# EAGLE design TouScruino-ui1-v0 (EAGLE 6.3)
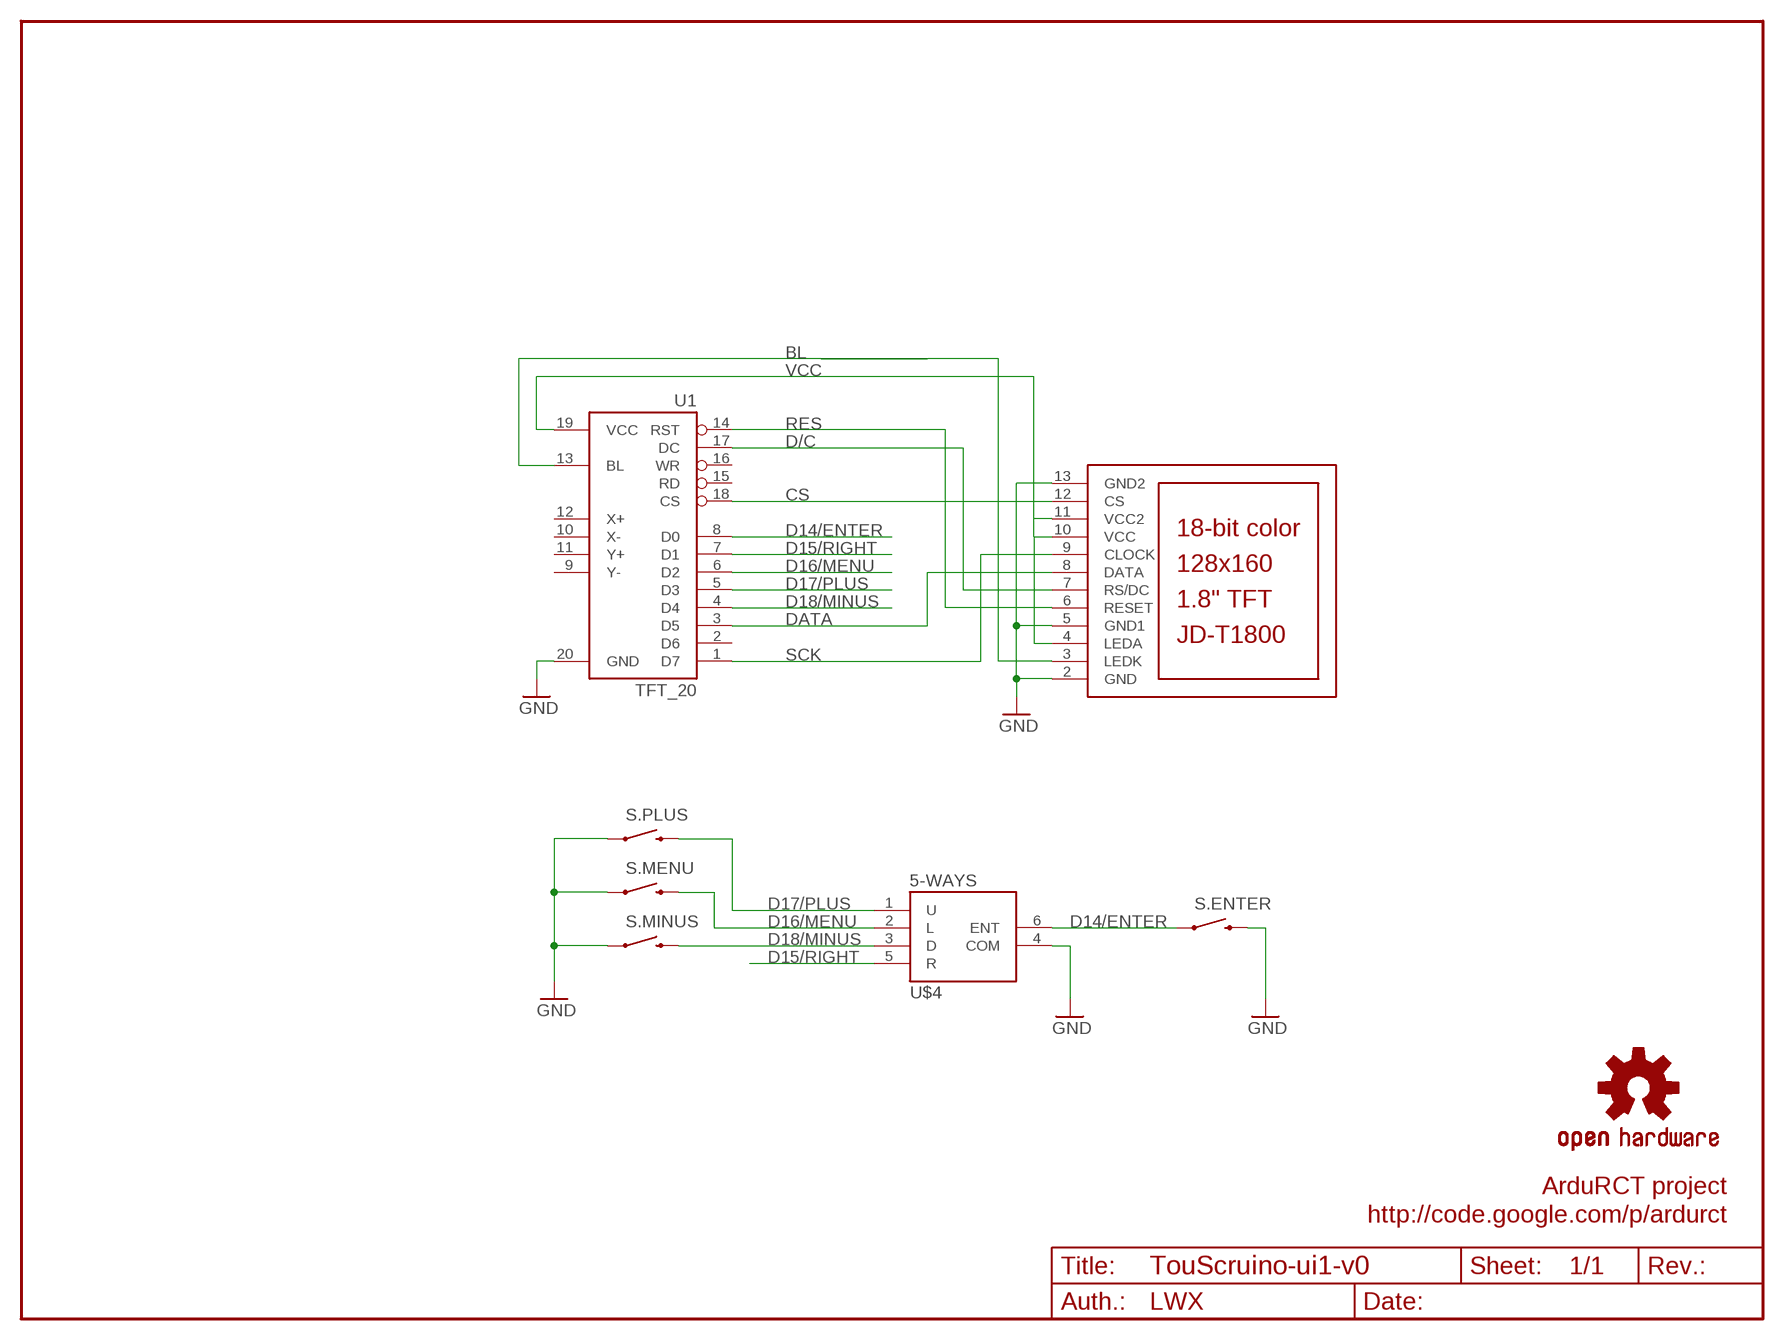
[diagram p0: schematic, sheet 1]

## Parts
LCD1  JD-T1800  [JD-T1800]
S.ENTER  SWITCH_SMD  [TACTILE_SWITCH_SMD]
S.MENU  SWITCH_SMD  [TACTILE_SWITCH_SMD]
S.MINUS  SWITCH_SMD  [TACTILE_SWITCH_SMD]
S.PLUS  SWITCH_SMD  [TACTILE_SWITCH_SMD]
U1  TFT_20  [TFT_20]
U$3  OSHW-LOGOM  [OSHW-LOGO-M]
U$4  5-WAYS  [5-WAYS_ALPS]

## Nets
BL: LCD1.3(LEDK) U1.13(BL)
CS: LCD1.12(CS) U1.18(CS)
D14/ENTER: S.ENTER.1 U1.8(D0) U$4.6(ENT)
D15/RIGHT: U1.7(D1) U$4.5(R)
D16/MENU: S.MENU.3 U1.6(D2) U$4.2(L)
D17/PLUS: S.PLUS.3 U1.5(D3) U$4.1(U)
D18/MINUS: S.MINUS.3 U1.4(D4) U$4.3(D)
D/C: LCD1.7(RS/DC) U1.17(DC)
DATA: LCD1.8(DATA) U1.3(D5)
GND: LCD1.2(GND) LCD1.5(GND1) LCD1.13(GND2) S.ENTER.3 S.MENU.1 S.MINUS.1 S.PLUS.1 U1.20(GND) U$4.4(COM)
RES: LCD1.6(RESET) U1.14(RST)
SCK: LCD1.9(CLOCK) U1.1(D7)
VCC: LCD1.4(LEDA) LCD1.10(VCC) LCD1.11(VCC2) U1.19(VCC)
Unconnected: U1.2(D6) U1.9(Y-) U1.10(X-) U1.11(Y+) U1.12(X+) U1.15(RD) U1.16(WR)

## Notes on the sheet
- ArduRCT project
- http://code.google.com/p/ardurct
- 1/1
- LWX

## Library data of the parts
LCD1 = adafruit:JD-T1800
S.ENTER S.MENU S.MINUS S.PLUS = wibauxl:SWITCH_SMD
U1 = wibauxl:TFT_20
U$3 = SparkFun:OSHW-LOGO: Open Source Hardware Logo This logo indicates the piece of hardware it is found on incorporates a OSHW license and/or adheres to the definition of open source hardware found here: http://freedomdefined.org/OSHW
U$4 = wibauxl:5-WAYS

## Net classes
0 default: width 0.203 mm
1 vcc: width 0.254 mm

## Board
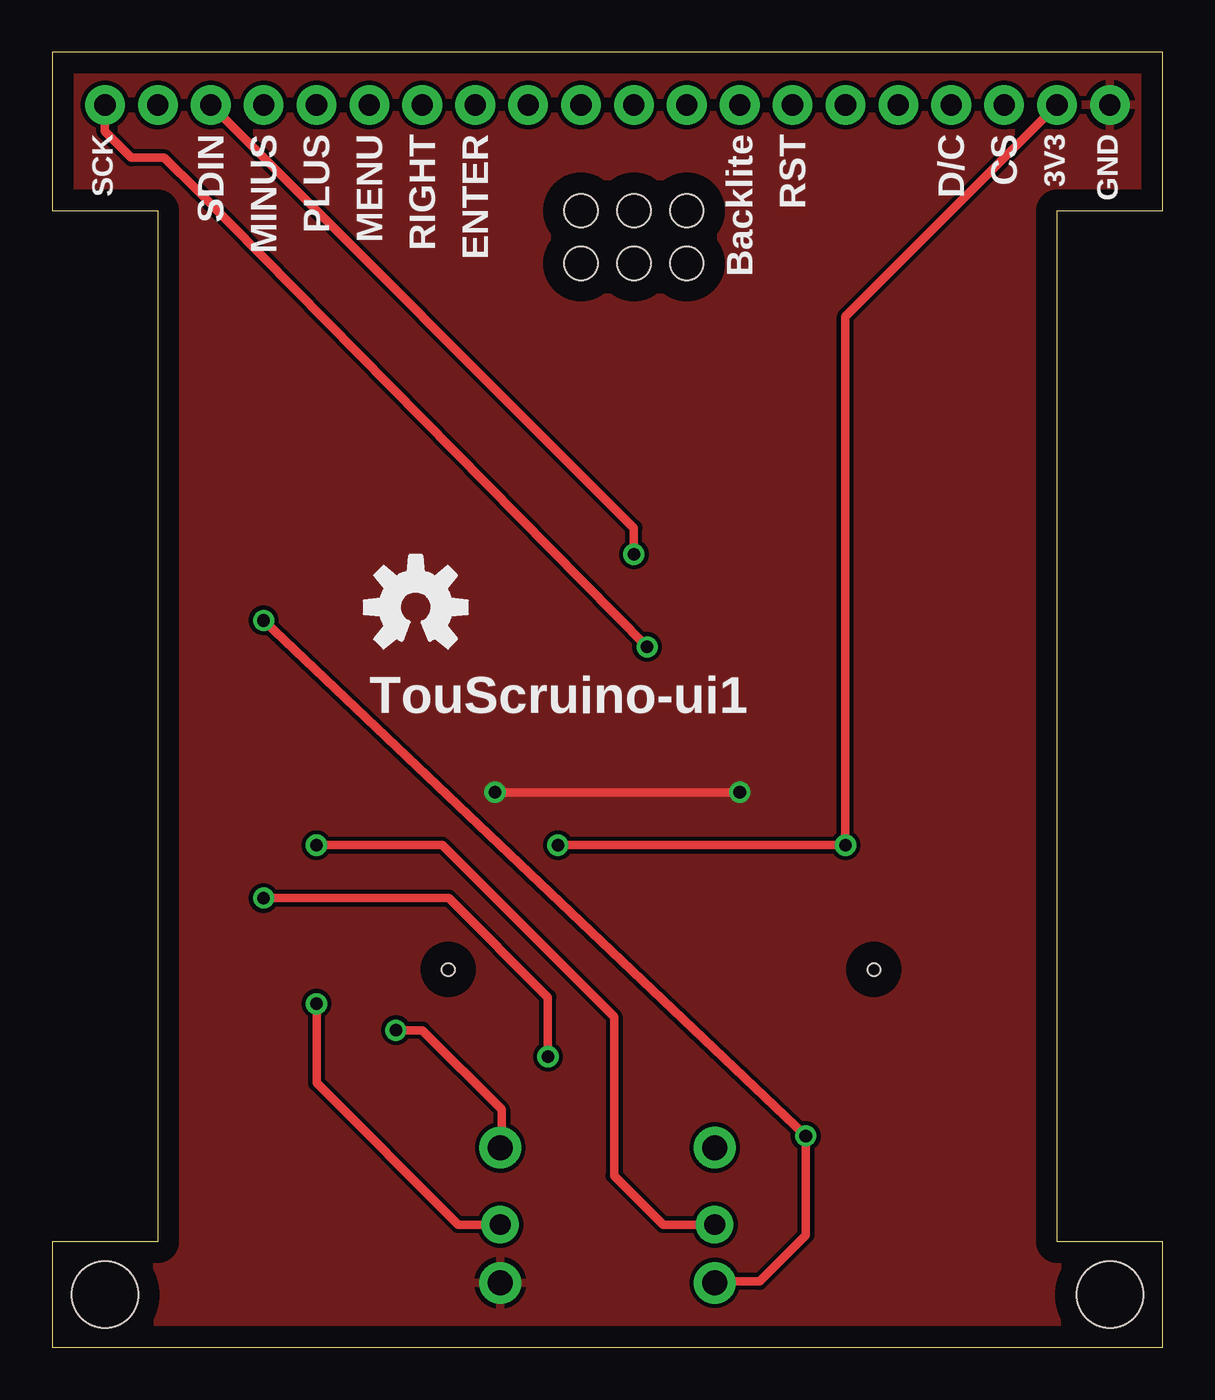
[diagram p1: board, top side]
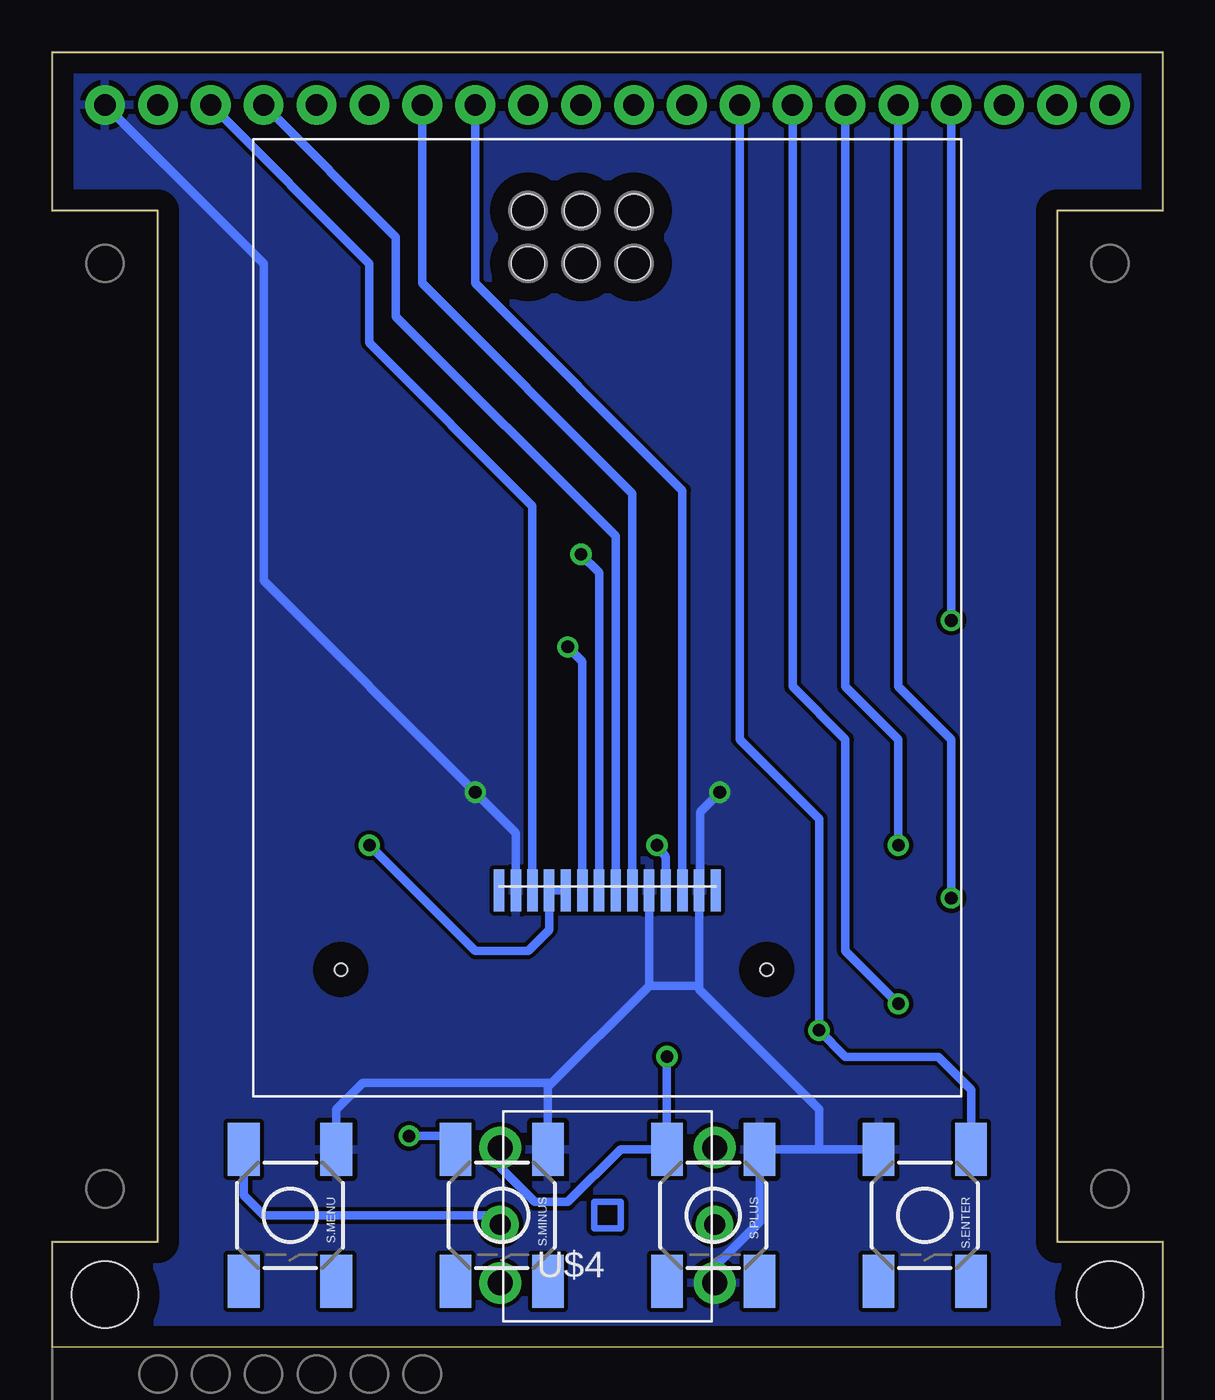
[diagram p2: board, bottom side, seen from below]

Size 53.34 x 62.23 mm. Coordinates in mm from the lower left corner, seen from the top.
Outline: 53.34,54.61 53.34,62.23 0,62.23 0,54.61 5.08,54.61 5.08,5.08 0,5.08 0,0 53.34,0 53.34,5.08 48.26,5.08 48.26,54.61 53.34,54.61
Copper layers (1*16): Top 0.035mm / dielectric 1.5mm / Bottom 0.035mm
Design rules "default": minimum track width 10mil, minimum drill 24mil, track to track 8mil, track to pad 8mil, pad to pad 8mil, via to via 8mil, smd to smd 8mil, copper to edge 40mil, drill to drill 8mil, minimum pad ring 10mil, minimum via ring 8mil, stop-mask expansion 4mil, vias tented up to drill 0mil, thermal gap 10mil
Holes 1.6 mm at 30.48,54.61 25.4,54.61 27.94,54.61 27.94,52.07 25.4,52.07 30.48,52.07
Holes 3.2 mm at 2.54,2.54 50.8,2.54

### Footprints (pad centres in the part's own frame; a part is rotated, then mirrored left to right if it is on the bottom)
JD-T1800 = smd 0.5 x 2: 1 5.2,-13.1; 2 4.4,-13.1; 3 3.6,-13.1; 4 2.8,-13.1; 5 2,-13.1; 6 1.2,-13.1; 7 0.4,-13.1; 8 -0.4,-13.1; 9 -1.2,-13.1; 10 -2,-13.1; 11 -2.8,-13.1; 12 -3.6,-13.1; 13 -4.4,-13.1; 14 -5.2,-13.1 | hole 0.61: -12.8,-16.9; 7.65,-16.9
TACTILE_SWITCH_SMD = smd 2.54 x 1.524: 1 -3.175,2.223; 2 3.175,2.223; 3 -3.175,-2.223; 4 3.175,-2.223
TFT_20 = drill 1.016 pad 1.905: 1 0,0; 2 -2.54,0; 3 -5.08,0; 4 -7.62,0; 5 -10.16,0; 6 -12.7,0; 7 -15.24,0; 8 -17.78,0; 9 -20.32,0; 10 -22.86,0; 11 -25.4,0; 12 -27.94,0; 13 -30.48,0; 14 -33.02,0; 15 -35.56,0; 16 -38.1,0; 17 -40.64,0; 18 -43.18,0; 19 -45.72,0; 20 -48.26,0
5-WAYS_ALPS = drill 1.2 pad 2: 1 -5.15,3.25; 3 -5.15,-3.25; 4 5.15,-3.25; 6 5.15,3.25 | drill 1 pad 1.8: 2 -5.15,-0.45; 5 5.15,-0.45

### Placement (x,y rotation side)
LCD1  26.67,35.05 0 bottom
S.ENTER  11.43,6.35 270 bottom
S.MENU  41.91,6.35 270 bottom
S.MINUS  31.75,6.35 270 bottom
S.PLUS  21.59,6.35 270 bottom
U1  2.54,59.69 0 bottom
U$3  17.46,35.56 0 top
U$4  26.67,6.35 0 bottom

### Tracks (layer width: path | path; a pad name or v marks a point on that pad's centre or on a via)
BL
  Bottom 0.406: LCD1.3 23.07,41.17 33.02,51.12 U1.13
CS
  Bottom 0.406: LCD1.12 30.27,40.43 38.1,48.26 38.1,52.07 U1.18
D14/ENTER  (via drill 0.61)
  Top 0.406: v16.51,15.24 17.78,15.24 21.59,11.43 21.59,9.67 U$4.6
  Bottom 0.406: 21.59,9.67 U$4.6 | U1.8 20.32,29.21 16.51,25.4 v16.51,15.24 15.24,13.97 10.79,13.97 9.21,12.38 S.ENTER.1
D15/RIGHT  (via drill 0.61)
  Top 0.406: U$4.5 19.5,5.9 12.7,12.7 v12.7,16.51
  Bottom 0.406: v12.7,16.51 15.24,19.05 15.24,29.21 17.78,31.75 U1.7
D16/MENU  (via drill 0.61)
  Top 0.406: U$4.2 29.34,5.9 26.99,8.26 26.99,15.88 18.73,24.13 v12.7,24.13
  Bottom 0.406: S.MENU.3 44.13,7.3 43.18,6.35 32.27,6.35 U$4.2 | U1.6 15.24,31.75 12.7,29.21 v12.7,24.13
D17/PLUS  (via drill 0.61)
  Top 0.406: v10.16,21.59 19.05,21.59 23.81,16.83 v23.81,13.97
  Bottom 0.406: U$4.1 31.82,8.64 30.16,6.99 28.57,6.99 26.04,9.53 S.PLUS.3 v23.81,13.97 | U1.5 12.7,31.75 10.16,29.21 v10.16,21.59
D18/MINUS  (via drill 0.61)
  Top 0.406: U$4.3 31.89,3.17 33.97,3.17 36.2,5.4 v36.2,10.16 v10.16,34.92
  Bottom 0.406: S.MINUS.3 34.29,10.16 v36.2,10.16 | U1.4 v10.16,34.92
D/C
  Bottom 0.406: LCD1.7 26.27,38.97 36.83,49.53 36.83,53.34 U1.17
DATA  (via drill 0.61)
  Top 0.406: v27.94,38.1 27.94,39.37 U1.3
  Bottom 0.406: LCD1.8 27.07,37.23 v27.94,38.1
GND  (via drill 0.61)
  Top 0.406: v21.27,26.67 v33.02,26.67
  Bottom 0.406: U1.20 43.18,52.07 43.18,36.83 v33.02,26.67 31.07,24.72 LCD1.13 | LCD1.5 24.67,17.37 | v21.27,26.67 22.23,25.72 22.23,21.59 22.27,21.55 LCD1.2 22.27,17.46 | S.MENU.1 39.69,11.43 38.42,12.7 29.53,12.7 29.53,12.51 | 29.53,12.51 S.MINUS.1 | S.ENTER.3 16.51,9.53 | 29.53,12.51 24.67,17.37 | 16.51,9.53 S.PLUS.1 19.37,6.03 21.52,3.88 U$4.4 | 16.51,9.53 16.51,11.43 22.27,17.19 22.27,17.46 | 24.67,17.37 22.36,17.37 22.27,17.46
  pour Top: 0,62.23 53.34,62.23 53.34,0 0,0
  pour Bottom: 0,62.23 53.34,62.23 53.34,0 0,0
RES
  Bottom 0.406: LCD1.6 25.47,41.03 35.56,51.12 U1.14
SCK  (via drill 0.61)
  Top 0.406: v28.57,33.66 6.99,55.56 5.4,57.15 3.81,57.15 2.54,58.42 U1.1
  Bottom 0.406: LCD1.9 27.87,32.95 v28.57,33.66
VCC  (via drill 0.61)
  Top 0.406: U1.19 38.1,49.53 v38.1,24.13 v24.29,24.13
  Bottom 0.406: v38.1,24.13 33.02,19.05 30.48,19.05 29.47,20.06 LCD1.11 LCD1.10 | LCD1.4 23.87,23.55 v24.29,24.13

### Text on the board
tPlace: SCK | SDIN | MINUS | PLUS | MENU | RIGHT | ENTER | Backlite | RST | D/C | CS | 3V3 | GND | TouScruino-ui1